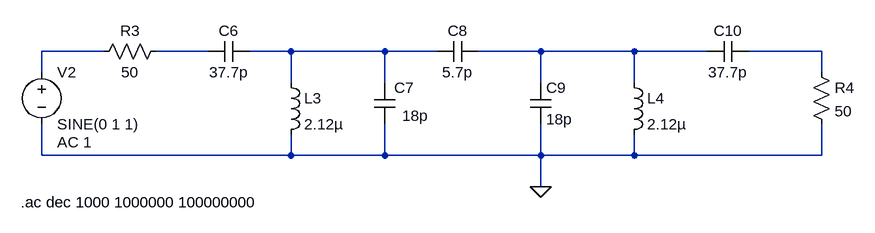
[diagram p0: schematic LC Double Tuned Bandpass Filters.asc]
LC Double Tuned Bandpass Filters.asc, the LTspice schematic file:
Version 4
SHEET 1 1184 712
WIRE 16 464 -80 464
WIRE 176 464 96 464
WIRE 304 464 240 464
WIRE 448 464 304 464
WIRE 528 464 448 464
WIRE 688 464 592 464
WIRE 832 464 688 464
WIRE 944 464 832 464
WIRE 1120 464 1008 464
WIRE -80 496 -80 464
WIRE 1120 496 1120 464
WIRE 304 512 304 464
WIRE 448 512 448 464
WIRE 688 512 688 464
WIRE 832 512 832 464
WIRE -80 624 -80 576
WIRE 304 624 304 592
WIRE 304 624 -80 624
WIRE 448 624 448 576
WIRE 448 624 304 624
WIRE 688 624 688 576
WIRE 688 624 448 624
WIRE 832 624 832 592
WIRE 832 624 688 624
WIRE 1120 624 1120 576
WIRE 1120 624 832 624
WIRE 688 672 688 624
FLAG 688 672 0
SYMBOL res 112 448 R90
WINDOW 0 0 56 VBottom 2
WINDOW 3 32 56 VTop 2
SYMATTR InstName R3
SYMATTR Value 50
SYMBOL cap 240 448 R90
WINDOW 0 0 32 VBottom 2
WINDOW 3 32 32 VTop 2
SYMATTR InstName C6
SYMATTR Value 37.7p
SYMBOL ind 288 496 R0
SYMATTR InstName L3
SYMATTR Value 2.12µ
SYMBOL cap 464 576 R180
WINDOW 0 -29 56 Left 2
WINDOW 3 -51 13 Left 2
SYMATTR InstName C7
SYMATTR Value 18p
SYMBOL cap 528 480 R270
WINDOW 0 32 32 VTop 2
WINDOW 3 0 32 VBottom 2
SYMATTR InstName C8
SYMATTR Value 5.7p
SYMBOL cap 672 512 R0
SYMATTR InstName C9
SYMATTR Value 18p
SYMBOL ind 816 496 R0
SYMATTR InstName L4
SYMATTR Value 2.12µ
SYMBOL cap 1008 448 R90
WINDOW 0 0 32 VBottom 2
WINDOW 3 32 32 VTop 2
SYMATTR InstName C10
SYMATTR Value 37.7p
SYMBOL res 1104 480 R0
SYMATTR InstName R4
SYMATTR Value 50
SYMBOL voltage -80 480 R0
WINDOW 123 24 124 Left 2
WINDOW 39 0 0 Left 2
SYMATTR Value2 AC 1
SYMATTR InstName V2
SYMATTR Value SINE(0 1 1)
TEXT -112 696 Left 2 !.ac dec 1000 1000000 100000000

The netlist it stands for:
* LC Double Tuned Bandpass Filters.asc
R3 N002 N001 50
C6 N003 N002 37.7p
L3 N003 0 2.12µ
C7 0 N003 18p
C8 N003 N004 5.7p
C9 N004 0 18p
L4 N004 0 2.12µ
C10 N005 N004 37.7p
R4 N005 0 50
V2 N001 0 SINE(0 1 1) AC 1
.ac dec 1000 1000000 100000000
.backanno
.end